# EAGLE design board_rfm95_v2 (EAGLE 7.7.0)
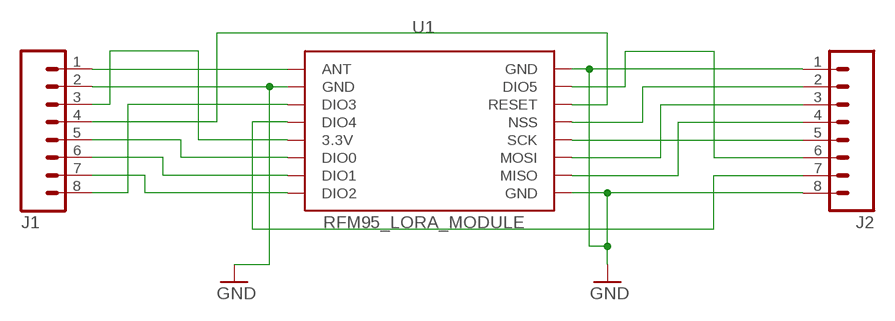
[diagram p0: schematic, sheet 1]

## Parts
J1  M08  [1X08_ROUND]
J2  M08  [1X08_ROUND]
U1  RFM95_LORA_MODULE  [RFM95]

## Nets
3.3V: J1.3 U1.3.3V
ANT: J1.1 U1.ANT
DIO0: J1.5 U1.DIO0
DIO1: J1.6 U1.DIO1
DIO2: J1.7 U1.DIO2
DIO4: J2.7 U1.DIO4
DIO5: J2.6 U1.DIO5
GND: J1.2 J2.1 J2.8 U1.GND U1.GND@1(GND) U1.GND@2(GND)
MISO: J2.4 U1.MISO
MOSI: J2.3 U1.MOSI
N$8: J1.8 U1.DIO3
NSS: J2.2 U1.NSS
RST: J1.4 U1.RESET
SCK: J2.5 U1.SCK

## Library data of the parts
J1 J2 = SparkFun-Connectors:M08: Header 8 Standard 8-pin 0.1" header. Use with straight break away headers (SKU : PRT-00116), right angle break away headers (PRT-00553), swiss pins (PRT-00743), machine pins (PRT-00117), and female headers (PRT-00115).; PROD_ID: CONN-08437
U1 = RFM95_Lora_module:RFM95_LORA_MODULE

## Net classes
1 rf: clearance 0.5 mm

## Board
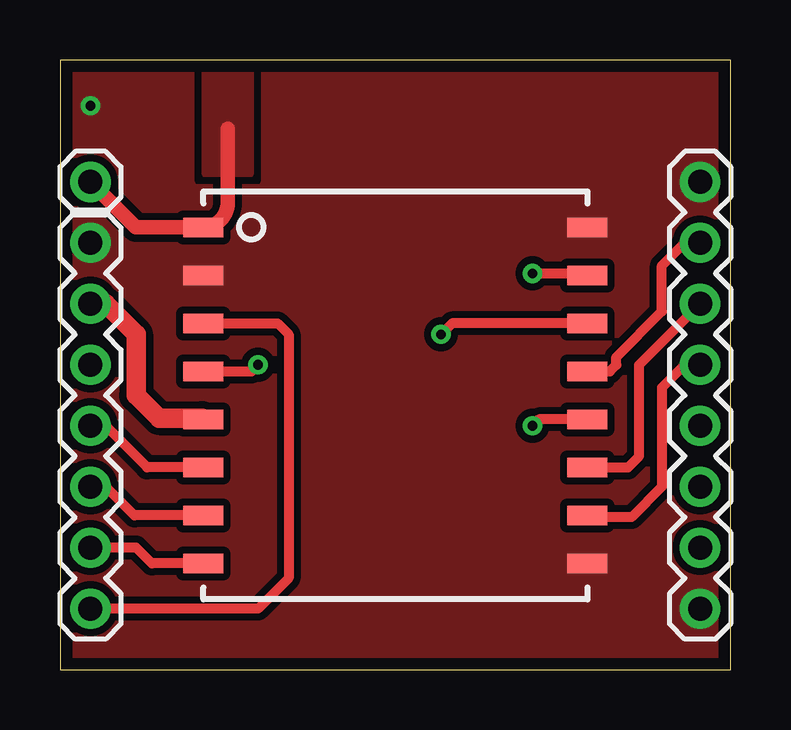
[diagram p1: board, top side]
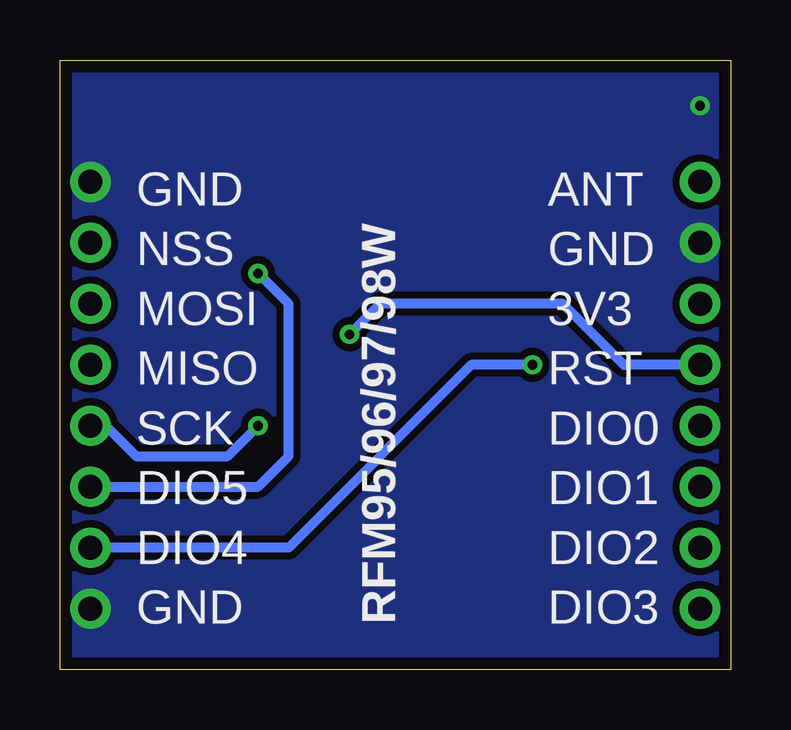
[diagram p2: board, bottom side, seen from below]

Size 27.94 x 25.4 mm. Coordinates in mm from the lower left corner, seen from the top.
Outline: 0,0 27.94,0 27.94,25.4 0,25.4 0,0
Copper layers (1*16): Top 0.035mm / dielectric 1.5mm / Bottom 0.035mm
Design rules "default *": minimum track width 10mil, minimum drill 0.4mm, track to track 0.3mm, track to pad 0.3mm, pad to pad 0.3mm, via to via 0.3mm, smd to smd 8mil, copper to edge 0.5mm, drill to drill 8mil, minimum pad ring 10mil, minimum via ring 8mil, stop-mask expansion 4mil, vias tented up to drill 0.8mm, thermal gap 10mil

### Footprints (pad centres in the part's own frame; a part is rotated, then mirrored left to right if it is on the bottom)
1X08_ROUND = drill 1 pad 1.676: 1 0,0; 2 2.54,0; 3 5.08,0; 4 7.62,0; 5 10.16,0; 6 12.7,0; 7 15.24,0; 8 17.78,0
RFM95 = smd 1.676 x 0.813: 3.3V -8,-1; ANT -8,7; DIO0 -8,-3; DIO1 -8,-5; DIO2 -8,-7; DIO3 -8,3; DIO4 -8,1; DIO5 8,5; GND -8,5; GND@1 8,7; GND@2 8,-7; MISO 8,-5; MOSI 8,-3; NSS 8,1; RESET 8,3; SCK 8,-1

### Placement (x,y rotation side)
J1  1.27,20.32 270 top
J2  26.67,20.32 270 top
U1  13.97,11.43 0 top

### Tracks (layer width: path | path; a pad name or v marks a point on that pad's centre or on a via)
3.3V
  Top 0.813: J1.3 1.91,15.24 3.17,13.97 3.17,11.43 4.13,10.48 5.92,10.48 U1.3.3V
ANT
  Top 0.61: 6.99,22.54 6.99,19.45 arc-90 U1.ANT 3.16,18.43 J1.1
  pour Top (isolate 0.305, no thermals): 6.03,25.4 7.94,25.4 7.94,20.64 6.03,20.64
DIO0
  Top 0.406: U1.DIO0 3.63,8.43 1.91,10.16 J1.5
DIO1
  Top 0.406: U1.DIO1 3.1,6.43 1.91,7.62 J1.6
DIO2
  Top 0.406: U1.DIO2 3.83,4.43 3.17,5.08 J1.7
DIO4  (via drill 0.4)
  Top 0.406: U1.DIO4 7.99,12.43 v8.26,12.7
  Bottom 0.406: v8.26,12.7 10.79,12.7 18.41,5.08 J2.7
DIO5  (via drill 0.4)
  Top 0.406: v19.68,16.51 21.89,16.51 U1.DIO5
  Bottom 0.406: J2.6 19.68,7.62 18.41,8.89 18.41,15.24 v19.68,16.51
GND  (via drill 0.4)
  other vias: 1.27,23.5
  pour Bottom (isolate 0.254, rank 3, no thermals): 0,25.4 27.94,25.4 27.94,0 0,0
  pour Top (isolate 0.254, rank 3, no thermals): 0,25.4 27.94,25.4 27.94,0 0,0
MISO
  Top 0.406: J2.4 26.04,12.7 25.08,11.75 25.08,7.62 23.81,6.35 22.05,6.35 U1.MISO
MOSI
  Top 0.406: U1.MOSI 23.67,8.43 24.13,8.89 24.13,12.7 J2.3
N$8
  Top 0.406: U1.DIO3 9.06,14.43 9.53,13.97 9.53,3.81 8.26,2.54 J1.8
NSS
  Top 0.406: U1.NSS 22.91,12.43 23.18,12.7 23.18,13.02 25.08,14.92 25.08,16.83 26.04,17.78 J2.2
RST  (via drill 0.4)
  Top 0.406: U1.RESET 16.34,14.43 v15.88,13.97
  Bottom 0.406: J1.4 4.45,12.7 6.99,15.24 14.61,15.24 v15.88,13.97
SCK  (via drill 0.4)
  Top 0.406: U1.SCK 19.95,10.43 v19.68,10.16
  Bottom 0.406: J2.5 26.04,10.16 24.77,8.89 20.95,8.89 v19.68,10.16

### Text on the board
bPlace: ANT / GND / 3V3 / RST / DIO0 / DIO1 / DIO2 / DIO3 | RFM95/96/97/98W | GND / NSS / MOSI / MISO / SCK / DIO5 / DIO4 / GND